# EAGLE design OLED Shield (EAGLE 6.4)
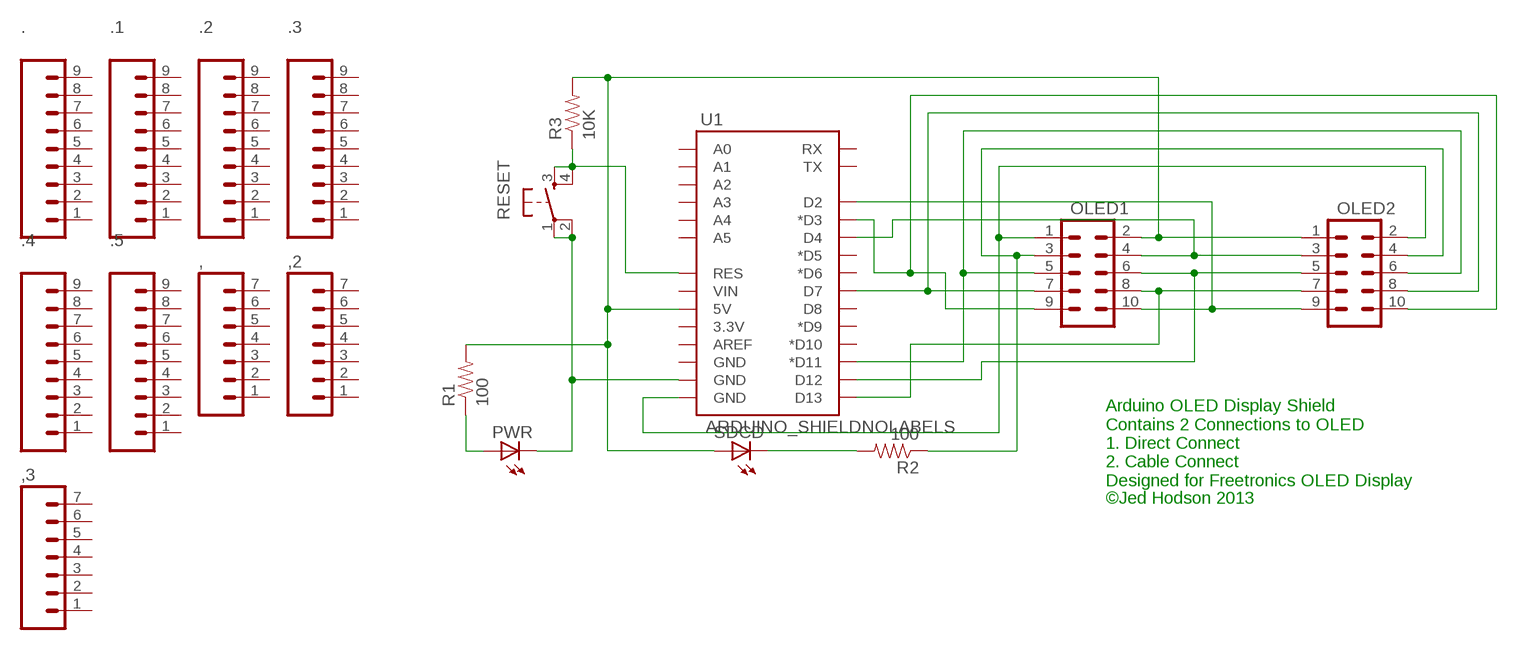
[diagram p0: schematic, sheet 1]

## Parts
,  M07  [1X07]
,2  M07  [1X07]
,3  M07  [1X07]
.  M09  [1X09]
.1  M09  [1X09]
.2  M09  [1X09]
.3  M09  [1X09]
.4  M09  [1X09]
.5  M09  [1X09]
OLED1  M05X2PTH  [AVR_ICSP]
OLED2  M05X2PTH  [AVR_ICSP]
PWR  LED5MM  [LED5MM]
R1  100  RESISTORPTH-1/4W  [AXIAL-0.4]
R2  100  RESISTORPTH-1/4W  [AXIAL-0.4]
R3  10K  RESISTORPTH-1/4W  [AXIAL-0.4]
RESET  TAC_SWITCHPTH  [TACTILE-PTH]
SDCD  LED5MM  [LED5MM]
U1  ARDUINO_SHIELDNOLABELS  [DUEMILANOVE_SHIELD_NOLABELS]

## Nets
N$1: OLED1.2 OLED2.1 R1.P$2 R3.P$2 SDCD.A U1.5V
N$2: PWR.A R1.P$1
N$3: OLED1.10 OLED2.9 U1.D2
N$4: OLED1.1 OLED2.2 U1.GND@0(GND)
N$5: OLED1.4 OLED2.3 U1.D4
N$6: R2.P$2 SDCD.K(C)
N$7: OLED1.6 OLED2.5 U1.D12
N$8: OLED1.5 OLED2.6 U1.D11(*D11)
N$9: OLED1.8 OLED2.7 U1.D13
N$10: OLED1.7 OLED2.8 U1.D7
N$11: PWR.K(C) RESET.1 RESET.2 U1.GND@1(GND)
N$12: R3.P$1 RESET.3 RESET.4 U1.RES
N$17: OLED1.3 OLED2.4 R2.P$1
N$18: OLED1.9 OLED2.10 U1.D3(*D3)
Unconnected: ,2.1 ,2.2 ,2.3 ,2.4 ,2.5 ,2.6 ,2.7 ,3.1 ,3.2 ,3.3 ,3.4 ,3.5 ,3.6 ,3.7 ,.1 ,.2 ,.3 ,.4 ,.5 ,.6 ,.7 .1.1 .1.2 .1.3 .1.4 .1.5 .1.6 .1.7 .1.8 .1.9 .2.1 .2.2 .2.3 .2.4 .2.5 .2.6 .2.7 .2.8 .2.9 .3.1 .3.2 .3.3 .3.4 .3.5 .3.6 .3.7 .3.8 .3.9 .4.1 .4.2 .4.3 .4.4 .4.5 .4.6 .4.7 .4.8 .4.9 .5.1 .5.2 .5.3 .5.4 .5.5 .5.6 .5.7 .5.8 .5.9 ..1 ..2 ..3 ..4 ..5 ..6 ..7 ..8 ..9 U1.3.3V U1.A0 U1.A1 U1.A2 U1.A3 U1.A4 U1.A5 U1.AREF U1.D5(*D5) U1.D6(*D6) U1.D8 U1.D9(*D9) U1.D10(*D10) U1.GND@2(GND) U1.RX U1.TX U1.VIN

## Notes on the sheet
- Arduino OLED Display Shield 
  Contains 2 Connections to OLED
  1. Direct Connect
  2. Cable Connect
  Designed for Freetronics OLED Display
- ©Jed Hodson 2013

## Library data of the parts
, ,2 ,3 = SparkFun-Connectors:M07: Header 7 Standard 7-pin 0.1" header. Use with straight break away headers (SKU : PRT-00116), right angle break away headers (PRT-00553), swiss pins (PRT-00743), machine pins (PRT-00117), and female headers (PRT-00115). NOTES ON THE VARIANTS LOCK and LOCK_LONGPADS... This footprint was designed to help hold the alignment of a through-hole component (i.e. 7-pin header) while soldering it into place. You may notice that each hole has been shifted either up or down by 0.005 of an inch from it's more standard position (which is usually a perfectly straight line). This slight alteration caused the pins (the squares in the middle) to touch the edges of the holes. Because they are alternating, it causes a "brace" to hold the header in place. 0.005 has proven to be the perfect amount of "off-center" position when using our standard breakaway headers. Although looks a little odd when you look at the bare footprint, once you have a header in there, the alteration is very hard to notice. Also, if you push a header all the way into place, it is covered up entirely on the bottom side. This idea of altering the position of holes to aid alignment will be further integrated into the Sparkfun Library for other footprints. It can help hold any component with 3 or more connection pins.
. .1-.5 = SparkFun-Connectors:M09: Header 9 Standard 9-pin 0.1" header. Use with straight break away headers (SKU : PRT-00116), right angle break away headers (PRT-00553), swiss pins (PRT-00743), machine pins (PRT-00117), and female headers (PRT-00115).
OLED1 OLED2 = SparkFun-Connectors:M05X2: Header 5x2 Standard 10-pin dual row 0.1" header. Commonly used with AVR-ISP. Use with Spark Fun Electronics SKU: PRT-00778
PWR SDCD = led:LED: LED OSRAM: - CHIPLED LG R971, LG N971, LY N971, LG Q971, LY Q971, LO R971, LY R971 LH N974, LH R974 LS Q976, LO Q976, LY Q976 LO Q996 - Hyper CHIPLED LW Q18S LB Q993, LB Q99A, LB R99A - SideLED LS A670, LO A670, LY A670, LG A670, LP A670 LB A673, LV A673, LT A673, LW A673 LH A674 LY A675 LS A676, LA A676, LO A676, LY A676, LW A676 LS A679, LY A679, LG A679 - Hyper Micro SIDELED® LS Y876, LA Y876, LO Y876, LY Y876 LT Y87S - SmartLED LW L88C, LW L88S LB L89C, LB L89S, LG L890 LS L89K, LO L89K, LY L89K LS L896, LA L896, LO L896, LY L896 - TOPLED LS T670, LO T670, LY T670, LG T670, LP T670 LSG T670, LSP T670, LSY T670, LOP T670, LYG T670 LG T671, LOG T671, LSG T671 LB T673, LV T673, LT T673, LW T673 LH T674 LS T676, LA T676, LO T676, LY T676, LB T676, LH T676, LSB T676, LW T676 LB T67C, LV T67C, LT T67C, LS T67K, LO T67K, LY T67K, LW E67C LS E67B, LA E67B, LO E67B, LY E67B, LB E67C, LV E67C, LT E67C LW T67C LS T679, LY T679, LG T679 LS T770, LO T770, LY T770, LG T770, LP T770 LB T773, LV T773, LT T773, LW T773 LH T774 LS E675, LA E675, LY E675, LS T675 LS T776, LA T776, LO T776, LY T776, LB T776 LHGB T686 LT T68C, LB T68C - Hyper Mini TOPLED® LB M676 - Mini TOPLED Santana® LG M470 LS M47K, LO M47K, LY M47K Source: http://www.osram.convergy.de LUXEON: - LUMILED® LXK2-PW12-R00, LXK2-PW12-S00, LXK2-PW14-U00, LXK2-PW14-V00 LXK2-PM12-R00, LXK2-PM12-S00, LXK2-PM14-U00 LXK2-PE12-Q00, LXK2-PE12-R00, LXK2-PE12-S00, LXK2-PE14-T00, LXK2-PE14-U00 LXK2-PB12-K00, LXK2-PB12-L00, LXK2-PB12-M00, LXK2-PB14-N00, LXK2-PB14-P00, LXK2-PB14-Q00 LXK2-PR12-L00, LXK2-PR12-M00, LXK2-PR14-Q00, LXK2-PR14-R00 LXK2-PD12-Q00, LXK2-PD12-R00, LXK2-PD12-S00 LXK2-PH12-R00, LXK2-PH12-S00 LXK2-PL12-P00, LXK2-PL12-Q00, LXK2-PL12-R00 Source: www.luxeon.com KINGBRIGHT: KA-3528ASYC Source: www.kingbright.com
R1-R3 = SparkFun-Passives:RESISTOR: Resistor Basic schematic elements and footprints for 0603, 1206, and PTH resistors.
RESET = SparkFun-Electromechanical:TAC_SWITCH: Momentary Switch Button commonly used for reset or general input. Spark Fun Electronics SKU : COM-00097 SMT- SWCH-08247
U1 = SparkFun-Boards:ARDUINO_SHIELD: Arduino shield footprint

## Board
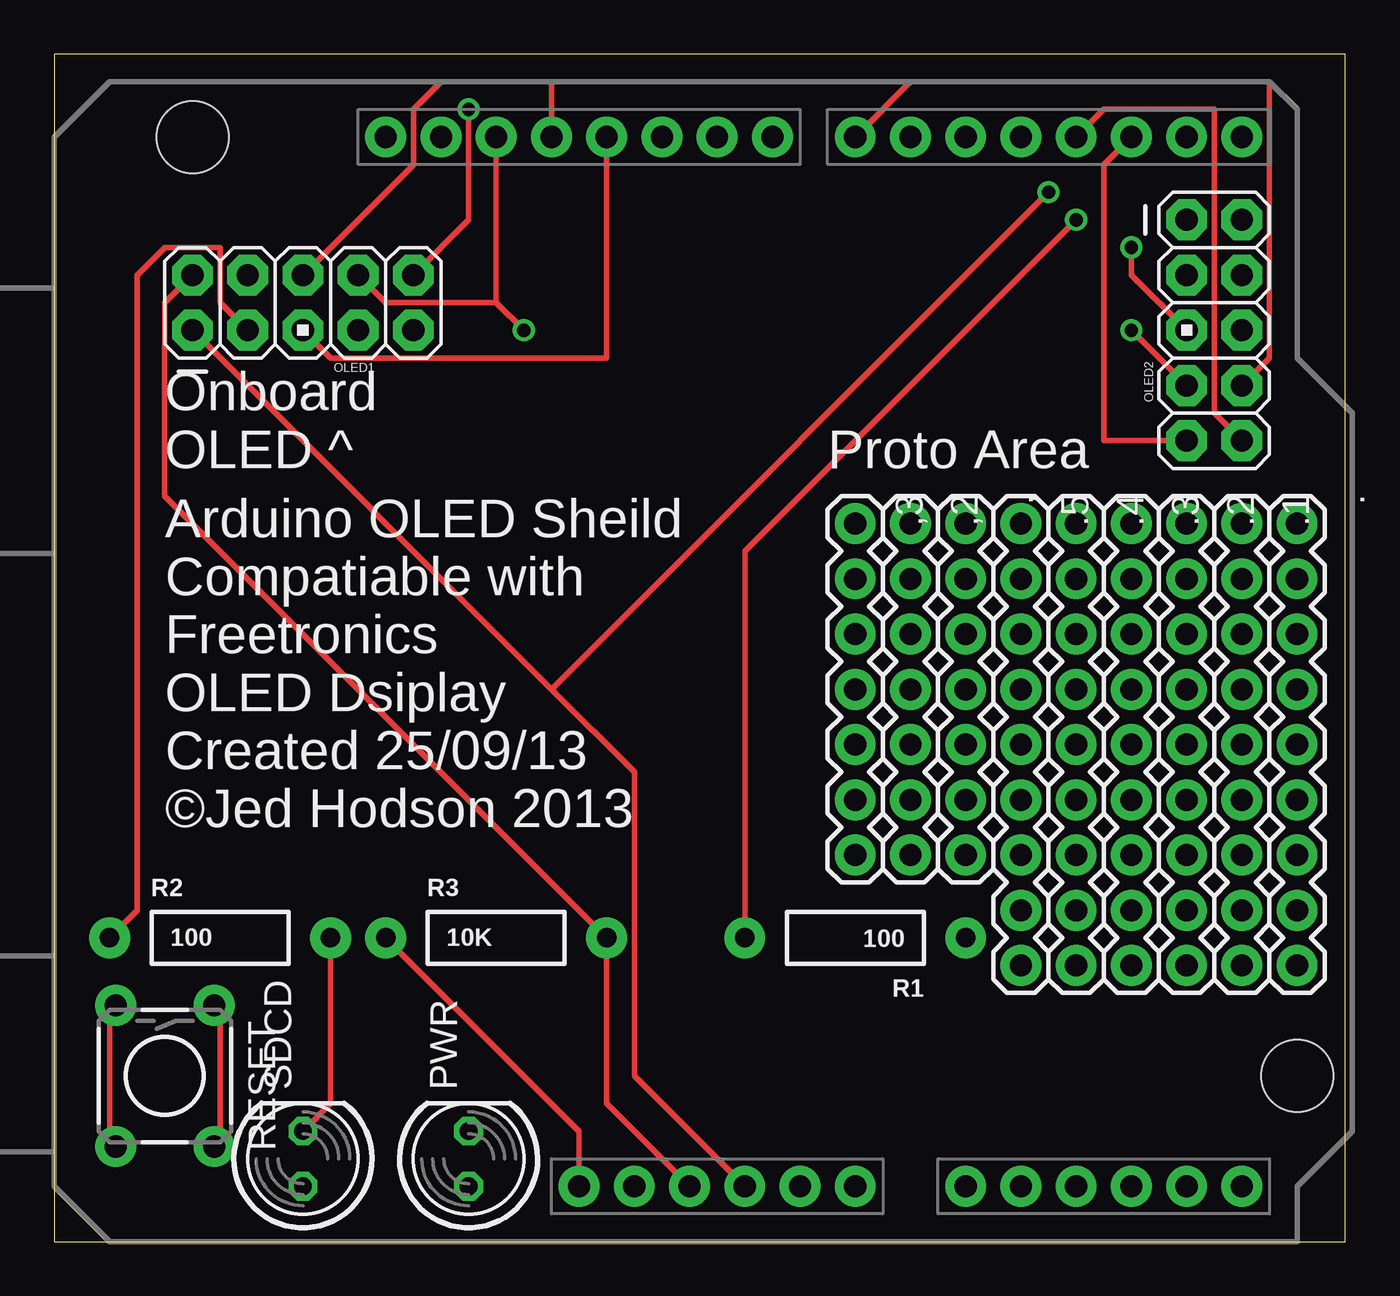
[diagram p1: board, top side]
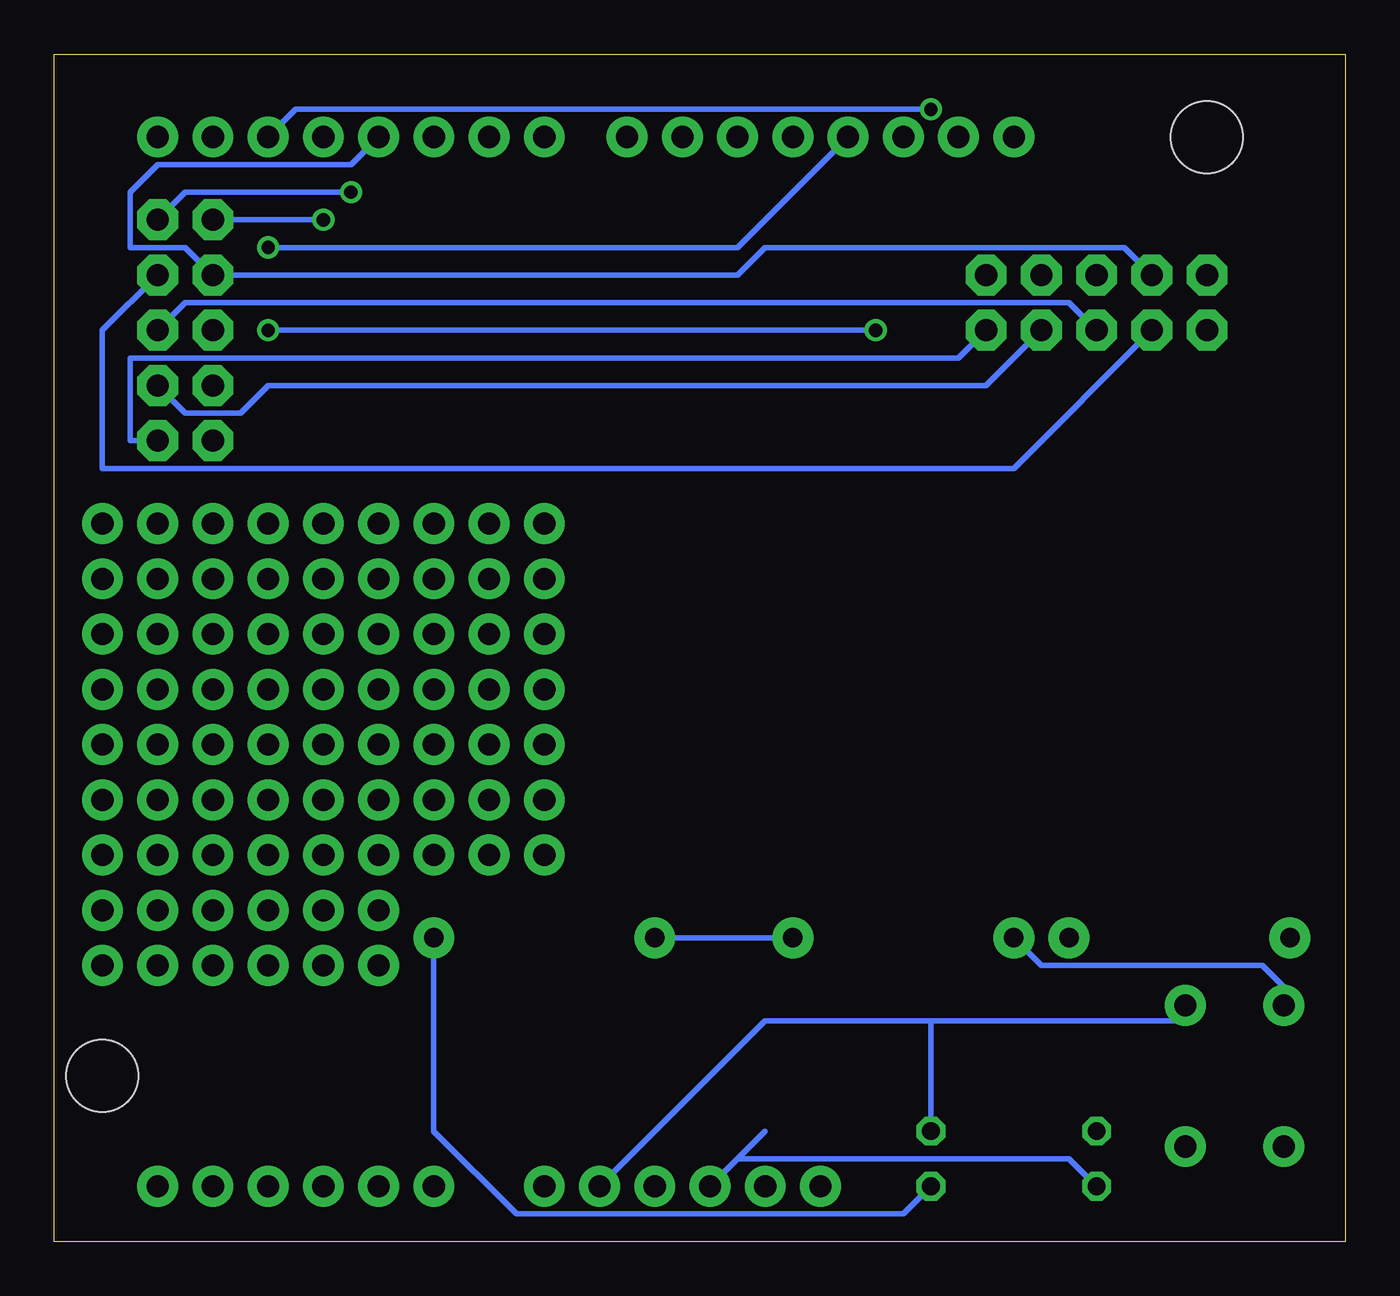
[diagram p2: board, bottom side, seen from below]

Size 59.36 x 54.6 mm. Coordinates in mm from the lower left corner, seen from the top.
Outline: 0,0 59.36,0 59.36,54.6 0,54.6 0,0
Copper layers (1*16): Top 0.035mm / dielectric 1.5mm / Bottom 0.035mm
Design rules "default": minimum track width 10mil, minimum drill 24mil, track to track 8mil, track to pad 8mil, pad to pad 8mil, via to via 8mil, smd to smd 8mil, copper to edge 40mil, drill to drill 8mil, minimum pad ring 10mil, minimum via ring 8mil, stop-mask expansion 4mil, vias tented up to drill 0mil, thermal gap 10mil

### Footprints (pad centres in the part's own frame; a part is rotated, then mirrored left to right if it is on the bottom)
1X07 = drill 1.016 pad 1.88: 1 0,0; 2 2.54,0; 3 5.08,0; 4 7.62,0; 5 10.16,0; 6 12.7,0; 7 15.24,0
1X09 = drill 1.016 pad 1.88: 1 0,0; 2 2.54,0; 3 5.08,0; 4 7.62,0; 5 10.16,0; 6 12.7,0; 7 15.24,0; 8 17.78,0; 9 20.32,0
AVR_ICSP = drill 1.016 pad 1.88 octagon: 1 -1.27,5.08; 2 1.27,5.08; 3 -1.27,2.54; 4 1.27,2.54; 5 -1.27,0; 6 1.27,0; 7 -1.27,-2.54; 8 1.27,-2.54; 9 -1.27,-5.08; 10 1.27,-5.08
LED5MM = drill 0.813 octagon: A -1.27,0; K 1.27,0
AXIAL-0.4 = drill 0.9 pad 1.88: P$1 -5.08,0; P$2 5.08,0
TACTILE-PTH = drill 1.016 pad 1.88: 1 -3.251,2.261; 2 3.251,2.261; 3 -3.251,-2.261; 4 3.251,-2.261
DUEMILANOVE_SHIELD_NOLABELS = drill 1.016 pad 1.88: 3.3V 50.8,26.67; 5V 50.8,29.21; A0 50.8,41.91; A1 50.8,44.45; A2 50.8,46.99; A3 50.8,49.53; A4 50.8,52.07; A5 50.8,54.61; AREF 2.54,15.24; D2 2.54,49.53; D3 2.54,46.99; D4 2.54,44.45; D5 2.54,41.91; D6 2.54,39.37; D7 2.54,36.83; D8 2.54,33.02; D9 2.54,30.48; D10 2.54,27.94; D11 2.54,25.4; D12 2.54,22.86; D13 2.54,20.32; GND@0 50.8,31.75; GND@1 50.8,34.29; GND@2 2.54,17.78; RES 50.8,24.13; RX 2.54,54.61; TX 2.54,52.07; VIN 50.8,36.83 | hole 3.302: 45.72,57.15; 2.54,6.35

### Placement (x,y rotation side)
,  41.91,33.02 270 top
,2  39.37,33.02 270 top
,3  36.83,33.02 270 top
.  57.15,33.02 270 top
.1  54.61,33.02 270 top
.2  52.07,33.02 270 top
.3  49.53,33.02 270 top
.4  46.99,33.02 270 top
.5  44.45,33.02 270 top
OLED1  11.43,43.18 90 top
OLED2  53.34,41.91 0 top
PWR  19.05,3.81 90 top
R1  36.83,13.97 180 top
R2  7.62,13.97 0 top
R3  20.32,13.97 0 top
RESET  5.08,7.62 270 top
SDCD  11.43,3.81 90 top
U1  0,53.34 270 top

### Tracks (layer width: path | path; a pad name or v marks a point on that pad's centre or on a via)
N$1  (via drill 0.61)
  Top 0.254: OLED1.2 5.08,43.18 5.08,34.29 R3.P$2 25.4,6.35 U1.5V | v46.99,46.99 31.75,31.75 R1.P$2
  Bottom 0.254: 26.67,5.08 27.94,3.81 | 27.94,3.81 U1.5V | R3.P$2 R1.P$2 | v46.99,46.99 OLED2.1 | SDCD.A 12.7,3.81 27.94,3.81
N$2
  Bottom 0.254: PWR.A 20.32,1.27 38.1,1.27 41.91,5.08 R1.P$1
N$3  (via drill 0.61)
  Top 0.254: OLED1.10 19.05,46.99 v19.05,52.07 | OLED2.9 48.26,36.83 48.26,49.53 U1.D2
  Bottom 0.254: v19.05,52.07 48.26,52.07 U1.D2
N$4  (via drill 0.61)
  Top 0.254: U1.GND@0 26.67,7.62 26.67,21.59 22.86,25.4 | OLED1.1 22.86,25.4 | 22.86,25.4 v45.72,48.26
  Bottom 0.254: OLED2.2 53.34,48.26 v45.72,48.26
N$5
  Bottom 0.254: OLED1.4 10.16,45.72 26.67,45.72 27.94,44.45 OLED2.3 53.34,45.72 55.88,45.72 55.88,48.26 54.61,49.53 45.72,49.53 U1.D4
N$6
  Top 0.254: SDCD.K 12.7,6.35 R2.P$2
N$7  (via drill 0.61)
  Top 0.254: OLED1.6 16.51,49.53 16.51,52.07 17.78,53.34 22.86,53.34 U1.D12 | OLED2.5 49.53,44.45 v49.53,45.72
  Bottom 0.254: v49.53,45.72 27.94,45.72 U1.D12
N$8
  Top 0.254: OLED1.5 12.7,40.64 25.4,40.64 U1.D11
  Bottom 0.254: OLED2.6 53.34,43.18 12.7,43.18 OLED1.5
N$9  (via drill 0.61)
  Top 0.254: OLED1.8 15.24,43.18 20.32,43.18 | U1.D13 20.32,43.18 | v49.53,41.91 OLED2.7 | 20.32,43.18 v21.59,41.91
  Bottom 0.254: v21.59,41.91 v49.53,41.91
N$10
  Top 0.254: U1.D7 39.37,53.34 55.88,53.34 55.88,40.64 OLED2.8
  Bottom 0.254: OLED1.7 16.51,39.37 49.53,39.37 50.8,38.1 53.34,38.1 OLED2.8
N$11
  Top 0.254: RESET.2 7.62,5.08 7.62,10.16 RESET.1
  Bottom 0.254: U1.GND@1 26.67,10.16 19.05,10.16 | 19.05,10.16 7.62,10.16 RESET.1 | 19.05,10.16 PWR.K
N$12
  Top 0.254: RESET.4 2.54,5.08 2.54,10.16 RESET.3 | R3.P$1 24.13,5.08 U1.RES
  Bottom 0.254: R3.P$1 13.97,12.7 3.81,12.7 2.54,11.43 RESET.3
N$17
  Top 0.254: R2.P$1 3.81,15.24 3.81,44.45 5.08,45.72 7.62,45.72 7.62,43.18 OLED1.3
  Bottom 0.254: OLED2.4 57.15,41.91 57.15,35.56 15.24,35.56 OLED1.3
N$18
  Top 0.254: U1.D3 48.26,52.07 53.34,52.07 53.34,38.1 OLED2.10
  Bottom 0.254: OLED1.9 17.78,40.64 55.88,40.64 55.88,36.83 OLED2.10

### Text on the board
tNames: Onboard / OLED ^ | Proto Area | Arduino OLED Sheild / Compatiable with / Freetronics / OLED Dsiplay / Created 25/09/13 / ©Jed Hodson 2013